# Altium schematic sheet 02 - AUX_POWER_SUPPLIES.SchDoc
size A3; SheetNumber: 2; SheetTotal: 7
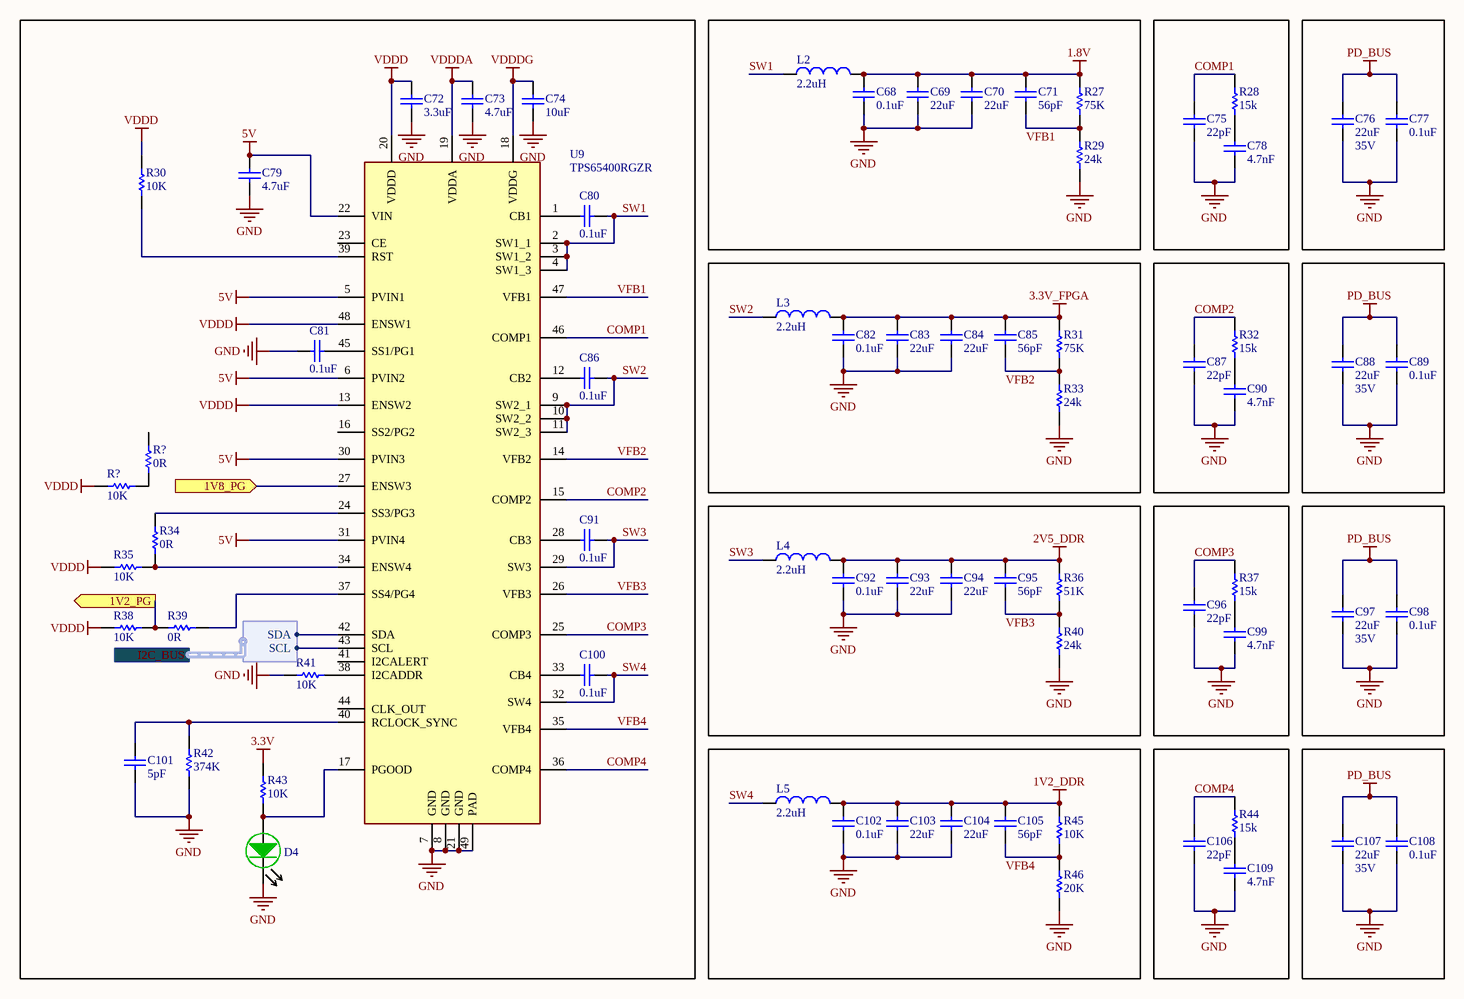
[diagram p0: 02 - AUX_POWER_SUPPLIES.SchDoc]

## Parts
(Parts that share a designator on the sheet are numbered #1, #2 ... from top to bottom, then left to right.)
C68  CAPACITANCE: 0.1uF  [0402-C-R]  (hidden comment: GRM155R71C104KA88J)
C69  value 22uF  [0603-C-R]  (hidden comment: GRM188R61A226ME15D)
C70  value 22uF  [0603-C-R]  (hidden comment: GRM188R61A226ME15D)
C71  value 56pF  [0402-C-R]  (hidden comment: GCM1555C1H560JA16D)
C72  value 3.3uF  [0402-C-R]  (hidden comment: C1005X5R1A335K050BC)
C73  value 4.7uF  [0402-C-R]  (hidden comment: GRM155D81C475ME15J)
C74  value 10uF  [0603-C-R]  (hidden comment: CAP SMD 0603 10uF 10V ±10%)
C75  value 22pF  [0402-C-R]  (hidden comment: GRM1555C1H220JA01D)
C76  value 22uF  VOLTAGE: 35V  [0805-C-R]  (hidden comment: C2012X5R1V226M125AC)
C77  value 0.1uF  [0402-C-R]  (hidden comment: GRM155R61E104KA87D)
C78  value 4.7nF  [0402-C-R]  (hidden comment: GRM155R71H472KA01D)
C79  value 4.7uF  [0402-C-R]  (hidden comment: GRM155D81C475ME15J)
C80  CAPACITANCE: 0.1uF  [0402-C-R]  (hidden comment: GRM155R71C104KA88J)
C81  value 0.1uF  [0402-C-R]  (hidden comment: GRM155R61E104KA87D)
C82  CAPACITANCE: 0.1uF  [0402-C-R]  (hidden comment: GRM155R71C104KA88J)
C83  value 22uF  [0603-C-R]  (hidden comment: GRM188R61A226ME15D)
C84  value 22uF  [0603-C-R]  (hidden comment: GRM188R61A226ME15D)
C85  value 56pF  [0402-C-R]  (hidden comment: GCM1555C1H560JA16D)
C86  CAPACITANCE: 0.1uF  [0402-C-R]  (hidden comment: GRM155R71C104KA88J)
C87  value 22pF  [0402-C-R]  (hidden comment: GRM1555C1H220JA01D)
C88  value 22uF  VOLTAGE: 35V  [0805-C-R]  (hidden comment: C2012X5R1V226M125AC)
C89  value 0.1uF  [0402-C-R]  (hidden comment: GRM155R61E104KA87D)
C90  value 4.7nF  [0402-C-R]  (hidden comment: GRM155R71H472KA01D)
C91  CAPACITANCE: 0.1uF  [0402-C-R]  (hidden comment: GRM155R71C104KA88J)
C92  CAPACITANCE: 0.1uF  [0402-C-R]  (hidden comment: GRM155R71C104KA88J)
C93  value 22uF  [0603-C-R]  (hidden comment: GRM188R61A226ME15D)
C94  value 22uF  [0603-C-R]  (hidden comment: GRM188R61A226ME15D)
C95  value 56pF  [0402-C-R]  (hidden comment: GCM1555C1H560JA16D)
C96  value 22pF  [0402-C-R]  (hidden comment: GRM1555C1H220JA01D)
C97  value 22uF  VOLTAGE: 35V  [0805-C-R]  (hidden comment: C2012X5R1V226M125AC)
C98  value 0.1uF  [0402-C-R]  (hidden comment: GRM155R61E104KA87D)
C99  value 4.7nF  [0402-C-R]  (hidden comment: GRM155R71H472KA01D)
C100  CAPACITANCE: 0.1uF  [0402-C-R]  (hidden comment: GRM155R71C104KA88J)
C101  value 5pF  [0402-C-R]  (hidden comment: GRM1555C1H5R0BA01D)
C102  CAPACITANCE: 0.1uF  [0402-C-R]  (hidden comment: GRM155R71C104KA88J)
C103  value 22uF  [0603-C-R]  (hidden comment: GRM188R61A226ME15D)
C104  value 22uF  [0603-C-R]  (hidden comment: GRM188R61A226ME15D)
C105  value 56pF  [0402-C-R]  (hidden comment: GCM1555C1H560JA16D)
C106  value 22pF  [0402-C-R]  (hidden comment: GRM1555C1H220JA01D)
C107  value 22uF  VOLTAGE: 35V  [0805-C-R]  (hidden comment: C2012X5R1V226M125AC)
C108  value 0.1uF  [0402-C-R]  (hidden comment: GRM155R61E104KA87D)
C109  value 4.7nF  [0402-C-R]  (hidden comment: GRM155R71H472KA01D)
D4  150060GS75000  [LED0603]  (value not drawn)
L2  value 2.2uH  [IND_SRP4020TA-2R2M]  (hidden comment: IND 2.2UH 4A 61 MOHM SMD)
L3  value 2.2uH  [IND_SRP4020TA-2R2M]  (hidden comment: IND 2.2UH 4A 61 MOHM SMD)
L4  value 2.2uH  [IND_SRP4020TA-2R2M]  (hidden comment: IND 2.2UH 4A 61 MOHM SMD)
L5  value 2.2uH  [IND_SRP4020TA-2R2M]  (hidden comment: IND 2.2UH 4A 61 MOHM SMD)
R27  Resistence: 75K  [0402-R-R]  (hidden comment: ERA-2AEB753X)
R28  value 15k  [0402-R-R]  (hidden comment: ERJ-2RKF1502X)
R29  Resistence: 24k  [0402-R-R]  (hidden comment: RT0402BRD0724KL)
R30  Resistence: 10K  [0402-R-R]  (hidden comment: RC0402JR-0710KL)
R31  Resistence: 75K  [0402-R-R]  (hidden comment: ERA-2AEB753X)
R32  value 15k  [0402-R-R]  (hidden comment: ERJ-2RKF1502X)
R33  Resistence: 24k  [0402-R-R]  (hidden comment: RT0402BRD0724KL)
R34  value 0R  [0402-R-R]  (hidden comment: RMCF0402ZT0R00)
R35  value 10K  [0402-R-R]  (hidden comment: RC0402FR-0710KL)
R36  Resistence: 51K  [0402-R-R]  (hidden comment: ERJ-2RKF5102X)
R37  value 15k  [0402-R-R]  (hidden comment: ERJ-2RKF1502X)
R38  value 10K  [0402-R-R]  (hidden comment: RC0402FR-0710KL)
R39  value 0R  [0402-R-R]  (hidden comment: RMCF0402ZT0R00)
R40  Resistence: 24k  [0402-R-R]  (hidden comment: RT0402BRD0724KL)
R41  Resistence: 10K  [0402-R-R]  (hidden comment: RC0402JR-0710KL)
R42  Resistence: 374K  [0402-R-R]  (hidden comment: RC0402FR-07374KL)
R43  value 10K  [0402-R-R]  (hidden comment: RC0402FR-0710KL)
R44  value 15k  [0402-R-R]  (hidden comment: ERJ-2RKF1502X)
R45  Resistence: 10K  [0402-R-R]  (hidden comment: RC0402JR-0710KL)
R46  Resistence: 20K  [0402-R-R]  (hidden comment: ERJ-2RKF2002X)
R?#1  value 10K  [0402-R-R]  (hidden comment: RC0402FR-0710KL)
R?#2  value 0R  [0402-R-R]  (hidden comment: RMCF0402ZT0R00)
U9  TPS65400RGZR  [QFN50P700X700X100-49N-D]

## Ports
1V2_PG (out), 1V8_PG (in), I2C_BUS (harness I2C)

## Harnesses
I2C: SCL, SDA

## Nets
1.8V: C68.2 C69.2 C70.2 C71.2 L2.2 R27.2
1V2_DDR: C102.2 C103.2 C104.2 C105.2 L5.2 R45.2
2V5_DDR: C92.2 C93.2 C94.2 C95.2 L4.2 R36.2
3.3V: R43.2
3.3V_FPGA: C82.2 C83.2 C84.2 C85.2 L3.2 R31.2
5V: C79.2 U9.5(PVIN1) U9.6(PVIN2) U9.22(VIN) U9.30(PVIN3) U9.31(PVIN4)
GND: C68.1 C69.1 C70.1 C72.1 C73.1 C74.1 C75.2 C76.1 C77.1 C78.2 C79.1 C81.1 C82.1 C83.1 C84.1 C87.2 C88.1 C89.1 C90.2 C92.1 C93.1 C94.1 C96.2 C97.1 C98.1 C99.2 C101.1 C102.1 C103.1 C104.1 C106.2 C107.1 C108.1 C109.2 D4.1(K) R29.1 R33.1 R40.1 R41.1 R42.1 R46.1 U9.7(GND) U9.8(GND) U9.21(GND) U9.49(PAD)
PD_BUS: C76.2 C77.2 C88.2 C89.2 C97.2 C98.2 C107.2 C108.2
VDDD: C72.2 R30.1 R35.1 R38.1 R?#1.1 U9.13(ENSW2) U9.20(VDDD) U9.48(ENSW1)
VDDDA: C73.2 U9.19(VDDA)
VDDDG: C74.2 U9.18(VDDG)
1V2_PG: R38.2 R39.1 ; port 1V2_PG
1V8_PG: U9.27(ENSW3) ; port 1V8_PG
COMP1: C75.1 R28.1 U9.46(COMP1)
COMP2: C87.1 R32.1 U9.15(COMP2)
COMP3: C96.1 R37.1 U9.25(COMP3)
COMP4: C106.1 R44.1 U9.36(COMP4)
SW1: C80.1 L2.1 U9.2(SW1_1) U9.3(SW1_2) U9.4(SW1_3)
SW2: C86.1 L3.1 U9.9(SW2_1) U9.10(SW2_2) U9.11(SW2_3)
SW3: C91.1 L4.1 U9.29(SW3)
SW4: C100.1 L5.1 U9.32(SW4)
VFB1: C71.1 R27.1 R29.2 U9.47(VFB1)
VFB2: C85.1 R31.1 R33.2 U9.14(VFB2)
VFB3: C95.1 R36.1 R40.2 U9.26(VFB3)
VFB4: C105.1 R45.1 R46.2 U9.35(VFB4)
NetC78_1: C78.1 R28.2
NetC80_2: C80.2 U9.1(CB1)
NetC81_2: C81.2 U9.45(SS1/PG1)
NetC86_2: C86.2 U9.12(CB2)
NetC90_1: C90.1 R32.2
NetC91_2: C91.2 U9.28(CB3)
NetC99_1: C99.1 R37.2
NetC100_2: C100.2 U9.33(CB4)
NetC101_2: C101.2 R42.2 U9.40(RCLOCK_SYNC)
NetC109_1: C109.1 R44.2
NetD4_2: D4.2(A) R43.1 U9.17(PGOOD)
NetR30_2: R30.2 U9.39(RST)
NetR34_1: R34.1 R35.2 U9.34(ENSW4)
NetR34_2: R34.2 U9.24(SS3/PG3)
NetR39_2: R39.2 U9.37(SS4/PG4)
NetR41_2: R41.2 U9.38(I2CADDR)
NetR?#1_2: R?#1.2 R?#2.1
NetU9_42: U9.42(SDA) ; port I2C_BUS.SDA
NetU9_43: U9.43(SCL) ; port I2C_BUS.SCL

Not connected (* = marked no-connect by the designer): R?#2 2; U9 16(SS2/PG2) 23(CE) 41(I2CALERT) 44(CLK_OUT)

## Notes on the sheet
- Nome da Sheet:
- Data:
- Projetista:
- PCB Design:
- LESC - Laboratório de Engenharia e Sistemas de Computação
- Campus do Pici - Bloco 723, S/N - Pici, Fortaleza - CE, 60455-970
- Julio Vitorino
- Revision:
- Size:

## Library data of the parts
C68 C80 C82 C86 C91 C92 C100 C102 = CAP CER 0.1UF 16V X7R 0402: 0.1 µF ±10% 16V Ceramic Capacitor X7R 0402 (1005 Metric) / PN: GRM155R71C104KA88J; Mfr_Name: Murata; PN: GRM155R71C104KA88J
C69 C70 C83 C84 C93 C94 C103 C104 = CAP CER 22UF 10V X5R 0603: 22 µF ±20% 10V Ceramic Capacitor X5R 0603 (1608 Metric); SIZE: 0603; PN: GRM188R61A226ME15D; VOLTAGE: 10V; TOLERANCE: 20%
C71 C85 C95 C105 = CAP CER 56PF 50V C0G/NP0 0402: 56 pF ±5% 50V Ceramic Capacitor C0G, NP0 0402 (1005 Metric); SIZE: 0402; PN: GCM1555C1H560JA16D; VOLTAGE: 50V; TOLERANCE: 5%
C72 = CAP CER 3.3UF 10V X5R 0402: 3.3 µF ±10% 10V Ceramic Capacitor X5R 0402 (1005 Metric); SIZE: 0402; PN: C1005X5R1A335K050BC; VOLTAGE: 10V; TOLERANCE: 10%
C73 C79 = CAP CER 4.7UF 25V X5R 0402: CAP SMD 0402 MLCC GERAL 4.7uF 25V ±20% 0402 X5s PN: GRM155D81C475ME15J MURATA; SIZE: 0402; VOLTAGE: 25V; TOLERANCE: 20%; PN: GRM155D81C475ME15J
C74 = CAP SMD 0603 10uF 10V ±10%: CAP SMD 0603 MLCC GERAL 10uF 10V ±10% X7R PN: GRM188Z71A106KA73D; SIZE: 0603; PN: GRM188Z71A106KA73D; VOLTAGE: 10V; TOLERANCE: 10%
C75 C87 C96 C106 = CAP CER 22PF 50V C0G/NPO 0402: 22 pF ±5% 50V Ceramic Capacitor C0G, NP0 0402 (1005 Metric); SIZE: 0402; PN: GRM1555C1H220JA01D; VOLTAGE: 50V; TOLERANCE: 5%
C76 C88 C97 C107 = CAP CER 22UF 35V X5R 0805: 22 µF ±20% 35V Ceramic Capacitor X5R 0805 (2012 Metric); SIZE: 0603; PN: C2012X5R1V226M125AC; TOLERANCE: 20%
C77 C81 C89 C98 C108 = CAP CER 0.1UF 25V X5R 0402: 0.1 µF ±10% 25V Ceramic Capacitor X5R 0402 (1005 Metric); SIZE: 0402; PN: GRM155R61E104KA87D; VOLTAGE: 25V; TOLERANCE: 10%
C78 C90 C99 C109 = CAP CER 4700PF 50V X7R 0402: 4700 pF ±10% 50V Capacitor de cerâmica X7R 0402 PN: GRM155R71H472KA01D; SIZE: 0402; PN: GRM155R71H472KA01D; VOLTAGE: 50V; TOLERANCE: 10%
C101 = CAP CER 5PF 50V C0G/NP0 0402: 5 pF ±0.1pF 50V Ceramic Capacitor C0G, NP0 0402 (1005 Metric); PN: C1005X5R1A335K050BC; TOLERANCE: 2%; SIZE: 0402; VOLTAGE: 50V
D4 = LED SMD VD 0603: LED SMD VD ALTO BRILHO 1,6x0,8x0,8mm 430mcd PN:150060GS75000 0603 WURTH; ID: ?; PN: 150060GS75000
L2-L5 = IND 2.2UH 4A 61 MOHM SMD: FIXED IND 2.2UH 4A 61 MOHM SMD PN: SRP4020TA-2R2M; MF: Murata Electronics; PN: SRP4020TA-2R2M; Package: 1608 ICS; DigiKey-Purchase-URL: https://snapeda.com/shop?store=DigiKey&id=4221634; Mouser-Purchase-URL: https://snapeda.com/shop?store=Mouser&id=4221634; SnapEDA_Link: https://www.snapeda.com/parts/DFE18SAN1R0ME0L/Applied%20Avionics/view-part/4221634/?ref=snap; Part Number: SRP4020TA-2R2M
R27 R31 = RES SMD 75K OHM 0.1% 1/16W 0402: 75 kOhms ±0.1% 0.063W, 1/16W Chip Resistor 0402 (1005 Metric) Automotive AEC-Q200 Thin Film; Mfr_Name: Panasonic; PN: ERA-2AEB753X; Tolerance: 0.1%
R28 R32 R37 R44 = RES SMD 15K OHM 1% 1/10W 0402: 15 kOhms ±1% 0.1W, 1/10W Chip Resistor 0402 (1005 Metric) Automotive AEC-Q200 Thick Film; PACK: 0402; TOLERANCE: 1%; POWER: 0.1W; PN: ERJ-2RKF1502X
R29 R33 R40 = RES SMD 24K OHM 0.1% 1/16W 0402: 24 kOhms ±0.1% 0.063W, 1/16W Chip Resistor 0402 (1005 Metric) Thin Film; Mfr_Name: Yageo; PN: RT0402BRD0724KL; Tolerance: 0.1%
R30 R41 R45 = RES 10K OHM 5% 1/16W 0402: 10 kOhms ±5% 0.063W, 1/16W Chip Resistor 0402 (1005 Metric) Moisture Resistant Thick Film; Mfr_Name: Yageo; PN: RC0402JR-0710KL; Tolerance: 5%
R34 R39 R?#2 = RES SMD 0402 0R 0.063W ±1%: RES SMD GERAL FILM 0R 0.063W ±1% 0402 7" TAPE PN: RMCF0402ZT0R00 STACKPOLE; PACK: 0402; TOLERANCE: 1%; POWER: 0.063W; PN: RMCF0402ZT0R00
R35 R38 R43 R?#1 = RES 10K OHM 1% 1/16W 0402: 10 kOhms ±1% 0,063W, 1/16W Resistor de chip 0402 (métrico 1005) Resistente à umidade Filme grosso; PACK: 0402; POWER: 0.063W; TOLERANCE: 1%; PN: RC0402FR-0710KL
R36 = RES SMD 51K OHM 1% 1/10W 0402: 51 kOhms ±1% 0.1W, 1/10W Chip Resistor 0402 (1005 Metric) Automotive AEC-Q200 Thick Film; Mfr_Name: Panasonic; PN: ERJ-2RKF5102X; Tolerance: 1%
R42 = RES 374K OHM 1% 1/16W 0402: 374 kOhms ±1% 0.063W, 1/16W Chip Resistor 0402 (1005 Metric) Moisture Resistant Thick Film; Mfr_Name: Yageo; PN: RC0402FR-07374KL; Tolerance: 1%
R46 = RES SMD 20K OHM 1% 1/10W 0402: 20 kOhms ±1% 0.1W, 1/10W Chip Resistor 0402 (1005 Metric) Automotive AEC-Q200 Thick Film; Mfr_Name: Panasonic; PN: ERJ-2RKF2002X; Tolerance: 1%
U9 = IC REG BCK ADJ 4A/2A QUAD 48VQFN: Buck CI regulador de chaveamento Positivo Ajustável 0,6V 4 Saída 4A, 2A 48-VFQFN pad exposto; Manufacturer_Name: Texas Instruments; Geometry.Height: 1mm; Mouser Part Number: 595-TPS65400RGZR; Mouser Price/Stock: https://www.mouser.co.uk/ProductDetail/Texas-Instruments/TPS65400RGZR?qs=Lb6%252B0IsOw4%252Bg1%252BfY7t6%252Bmw%3D%3D; Datasheet Link: http://www.ti.com/lit/gpn/tps65400; PN: TPS65400RGZR